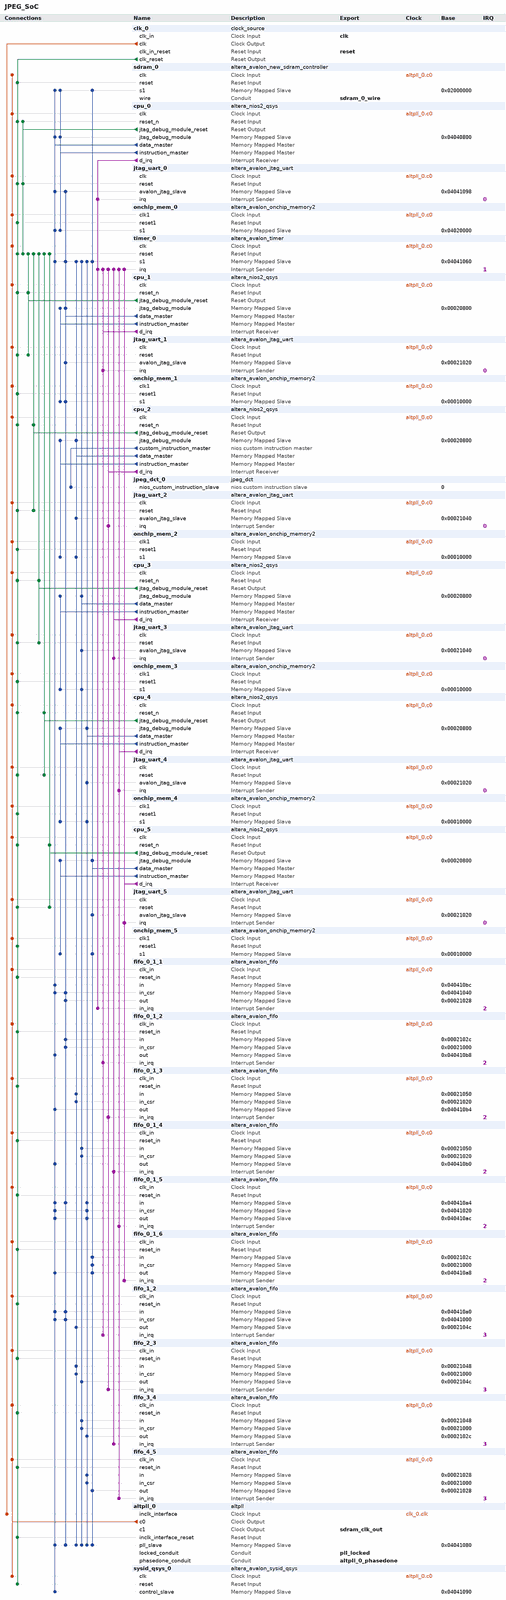
[diagram p0: system contents, whole]
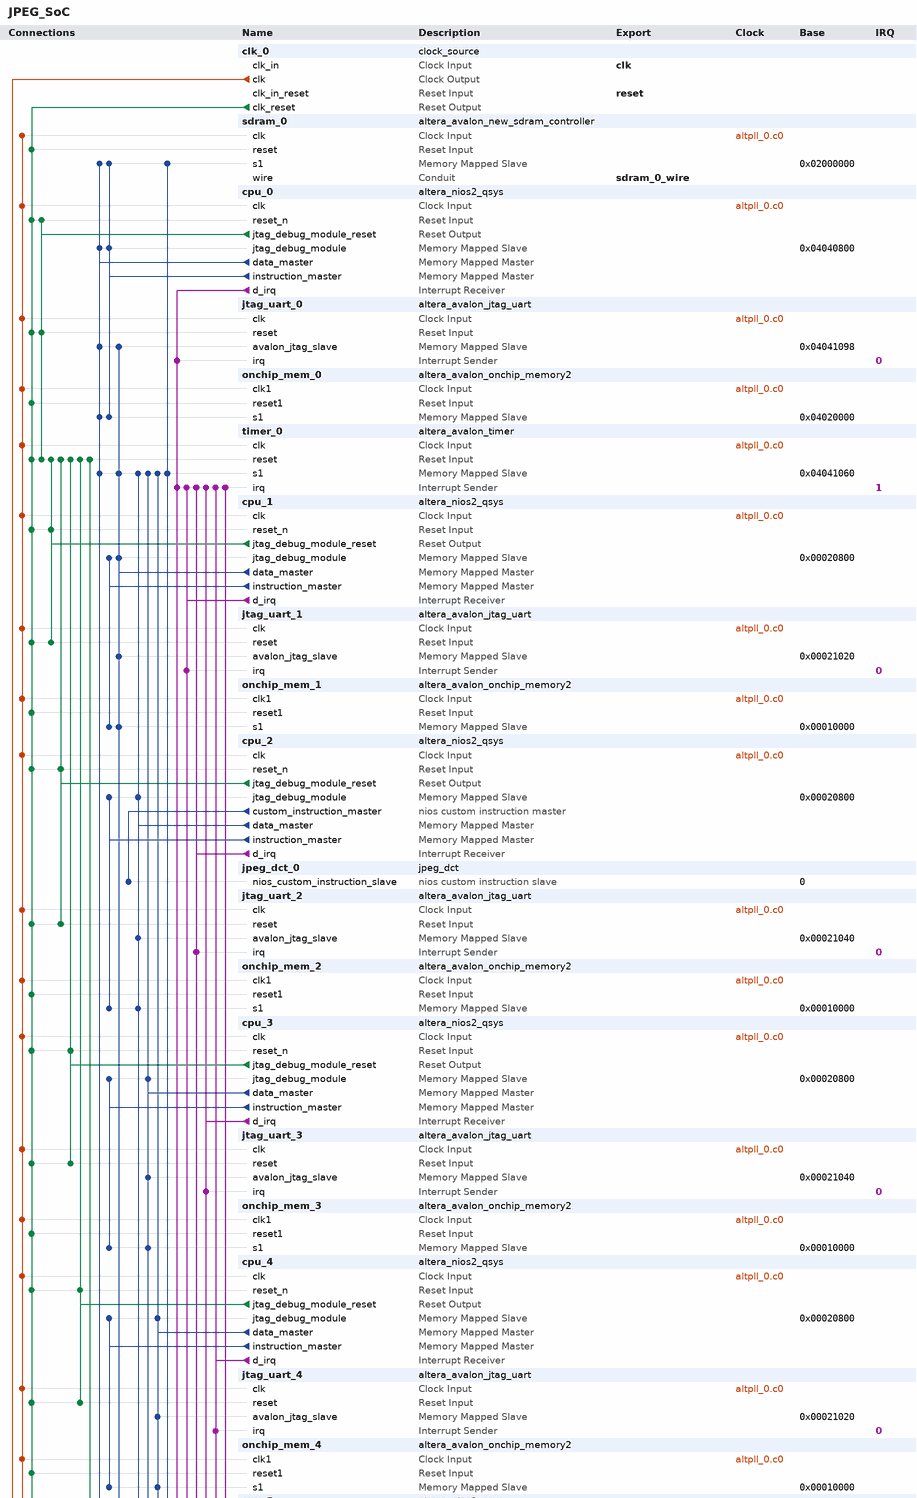
[diagram p1: system contents, upper part]
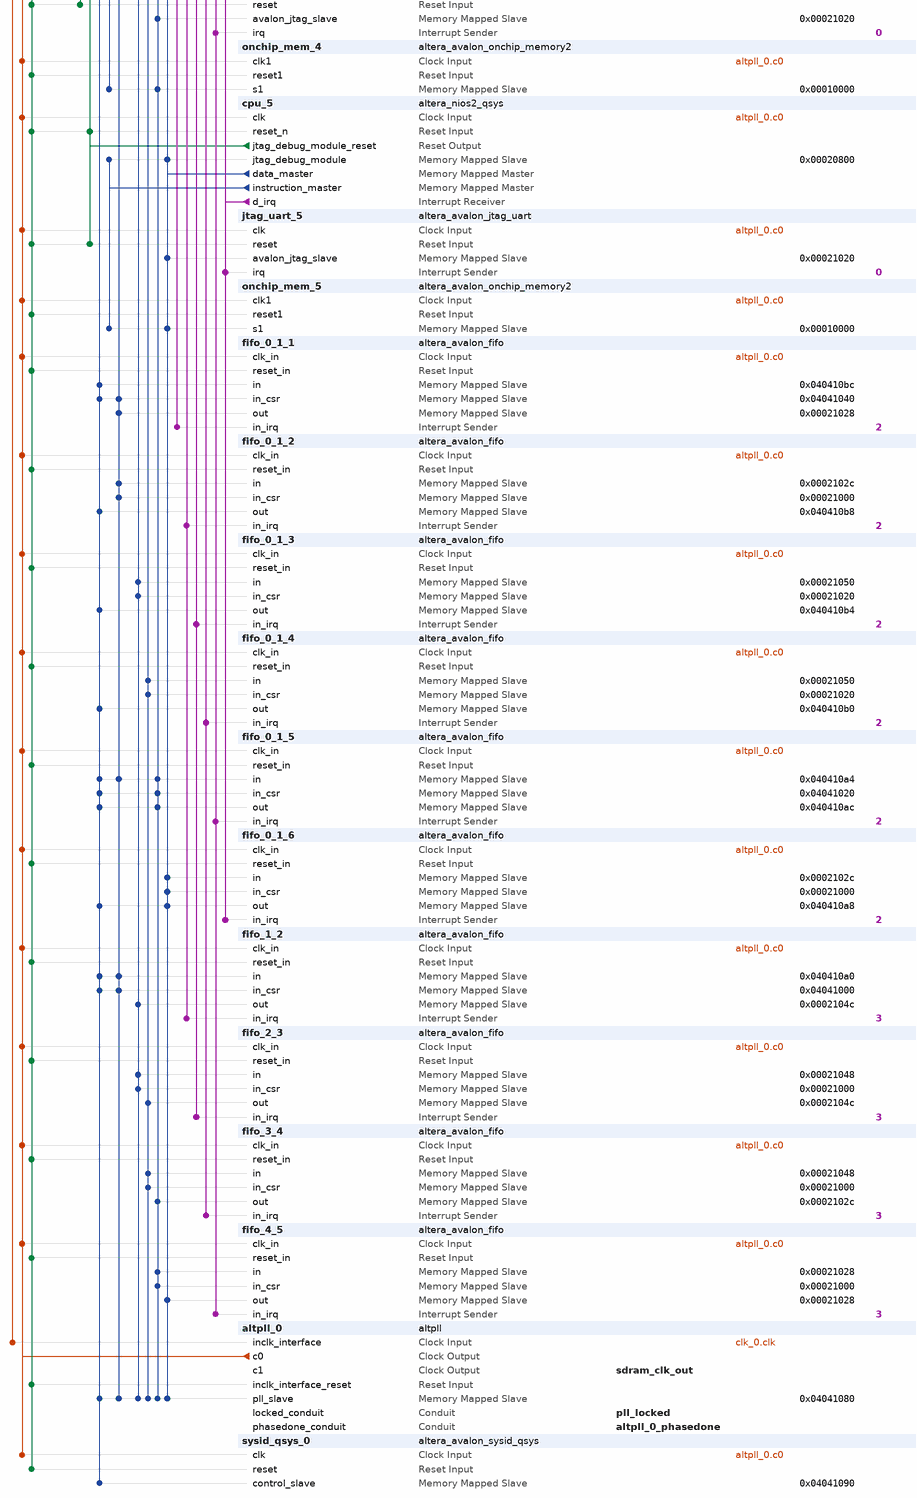
[diagram p2: system contents, lower part]
# Platform Designer (Qsys) system JPEG_SoC, Cyclone IV E EP4CE115F29C7
# Parameters at their usual value, and those the tool derives, are not listed.
package require -exact qsys 13.1
create_system JPEG_SoC
set_project_property DEVICE_FAMILY {Cyclone IV E}
set_project_property DEVICE EP4CE115F29C7

add_instance clk_0 clock_source 13.1
set_instance_parameter_value clk_0 clockFrequency 50000000

add_instance sdram_0 altera_avalon_new_sdram_controller 13.1
set_instance_parameter_value sdram_0 TAC 5.5
set_instance_parameter_value sdram_0 TRCD 20.0
set_instance_parameter_value sdram_0 TRP 20.0
set_instance_parameter_value sdram_0 casLatency 3
set_instance_parameter_value sdram_0 columnWidth 9
set_instance_parameter_value sdram_0 dataWidth 32
set_instance_parameter_value sdram_0 generateSimulationModel false
set_instance_parameter_value sdram_0 model custom
set_instance_parameter_value sdram_0 numberOfBanks 4
set_instance_parameter_value sdram_0 numberOfChipSelects 1
set_instance_parameter_value sdram_0 powerUpDelay 100.0
set_instance_parameter_value sdram_0 refreshPeriod 15.625
set_instance_parameter_value sdram_0 rowWidth 12

add_instance cpu_0 altera_nios2_qsys 13.1
set_instance_parameter_value cpu_0 resetSlave onchip_mem_0.s1
set_instance_parameter_value cpu_0 mmu_TLBMissExcSlave None
set_instance_parameter_value cpu_0 exceptionSlave onchip_mem_0.s1
set_instance_parameter_value cpu_0 breakSlave cpu_0.jtag_debug_module
set_instance_parameter_value cpu_0 muldiv_multiplierType DSPBlock
set_instance_parameter_value cpu_0 impl Tiny
set_instance_parameter_value cpu_0 icache_size 4096

add_instance jtag_uart_0 altera_avalon_jtag_uart 13.1
set_instance_parameter_value jtag_uart_0 simInteractiveOptions NO_INTERACTIVE_WINDOWS

add_instance onchip_mem_0 altera_avalon_onchip_memory2 13.1
set_instance_parameter_value onchip_mem_0 dataWidth 32
set_instance_parameter_value onchip_mem_0 dualPort false
set_instance_parameter_value onchip_mem_0 initMemContent true
set_instance_parameter_value onchip_mem_0 initializationFileName onchip_mem.hex
set_instance_parameter_value onchip_mem_0 memorySize 131072

add_instance timer_0 altera_avalon_timer 13.1
set_instance_parameter_value timer_0 period 1
set_instance_parameter_value timer_0 periodUnits MSEC

add_instance cpu_1 altera_nios2_qsys 13.1
set_instance_parameter_value cpu_1 cpuID 1
set_instance_parameter_value cpu_1 resetSlave onchip_mem_1.s1
set_instance_parameter_value cpu_1 mmu_TLBMissExcSlave None
set_instance_parameter_value cpu_1 exceptionSlave onchip_mem_1.s1
set_instance_parameter_value cpu_1 breakSlave cpu_1.jtag_debug_module
set_instance_parameter_value cpu_1 muldiv_multiplierType DSPBlock
set_instance_parameter_value cpu_1 impl Tiny
set_instance_parameter_value cpu_1 icache_size 4096

add_instance jtag_uart_1 altera_avalon_jtag_uart 13.1
set_instance_parameter_value jtag_uart_1 simInteractiveOptions NO_INTERACTIVE_WINDOWS

add_instance onchip_mem_1 altera_avalon_onchip_memory2 13.1
set_instance_parameter_value onchip_mem_1 dataWidth 32
set_instance_parameter_value onchip_mem_1 dualPort false
set_instance_parameter_value onchip_mem_1 initMemContent true
set_instance_parameter_value onchip_mem_1 initializationFileName onchip_mem.hex
set_instance_parameter_value onchip_mem_1 memorySize 49152

add_instance cpu_2 altera_nios2_qsys 13.1
set_instance_parameter_value cpu_2 cpuID 2
set_instance_parameter_value cpu_2 resetSlave onchip_mem_2.s1
set_instance_parameter_value cpu_2 mmu_TLBMissExcSlave None
set_instance_parameter_value cpu_2 exceptionSlave onchip_mem_2.s1
set_instance_parameter_value cpu_2 breakSlave cpu_2.jtag_debug_module
set_instance_parameter_value cpu_2 muldiv_multiplierType DSPBlock
set_instance_parameter_value cpu_2 impl Tiny
set_instance_parameter_value cpu_2 icache_size 4096

add_instance jpeg_dct_0 jpeg_dct 2.0

add_instance jtag_uart_2 altera_avalon_jtag_uart 13.1
set_instance_parameter_value jtag_uart_2 simInteractiveOptions NO_INTERACTIVE_WINDOWS

add_instance onchip_mem_2 altera_avalon_onchip_memory2 13.1
set_instance_parameter_value onchip_mem_2 dataWidth 32
set_instance_parameter_value onchip_mem_2 dualPort false
set_instance_parameter_value onchip_mem_2 initMemContent true
set_instance_parameter_value onchip_mem_2 initializationFileName onchip_mem.hex
set_instance_parameter_value onchip_mem_2 memorySize 49152

add_instance cpu_3 altera_nios2_qsys 13.1
set_instance_parameter_value cpu_3 cpuID 3
set_instance_parameter_value cpu_3 resetSlave onchip_mem_3.s1
set_instance_parameter_value cpu_3 mmu_TLBMissExcSlave None
set_instance_parameter_value cpu_3 exceptionSlave onchip_mem_3.s1
set_instance_parameter_value cpu_3 breakSlave cpu_3.jtag_debug_module
set_instance_parameter_value cpu_3 muldiv_multiplierType DSPBlock
set_instance_parameter_value cpu_3 impl Tiny
set_instance_parameter_value cpu_3 icache_size 4096

add_instance jtag_uart_3 altera_avalon_jtag_uart 13.1
set_instance_parameter_value jtag_uart_3 simInteractiveOptions NO_INTERACTIVE_WINDOWS

add_instance onchip_mem_3 altera_avalon_onchip_memory2 13.1
set_instance_parameter_value onchip_mem_3 dataWidth 32
set_instance_parameter_value onchip_mem_3 dualPort false
set_instance_parameter_value onchip_mem_3 initMemContent true
set_instance_parameter_value onchip_mem_3 initializationFileName onchip_mem.hex
set_instance_parameter_value onchip_mem_3 memorySize 49152

add_instance cpu_4 altera_nios2_qsys 13.1
set_instance_parameter_value cpu_4 cpuID 4
set_instance_parameter_value cpu_4 resetSlave onchip_mem_4.s1
set_instance_parameter_value cpu_4 mmu_TLBMissExcSlave None
set_instance_parameter_value cpu_4 exceptionSlave onchip_mem_4.s1
set_instance_parameter_value cpu_4 breakSlave cpu_4.jtag_debug_module
set_instance_parameter_value cpu_4 muldiv_multiplierType DSPBlock
set_instance_parameter_value cpu_4 impl Tiny
set_instance_parameter_value cpu_4 icache_size 4096

add_instance jtag_uart_4 altera_avalon_jtag_uart 13.1
set_instance_parameter_value jtag_uart_4 simInteractiveOptions NO_INTERACTIVE_WINDOWS

add_instance onchip_mem_4 altera_avalon_onchip_memory2 13.1
set_instance_parameter_value onchip_mem_4 dataWidth 32
set_instance_parameter_value onchip_mem_4 dualPort false
set_instance_parameter_value onchip_mem_4 initMemContent true
set_instance_parameter_value onchip_mem_4 initializationFileName onchip_mem.hex
set_instance_parameter_value onchip_mem_4 memorySize 65536

add_instance cpu_5 altera_nios2_qsys 13.1
set_instance_parameter_value cpu_5 cpuID 5
set_instance_parameter_value cpu_5 resetSlave onchip_mem_5.s1
set_instance_parameter_value cpu_5 mmu_TLBMissExcSlave None
set_instance_parameter_value cpu_5 exceptionSlave onchip_mem_5.s1
set_instance_parameter_value cpu_5 breakSlave cpu_5.jtag_debug_module
set_instance_parameter_value cpu_5 muldiv_multiplierType DSPBlock
set_instance_parameter_value cpu_5 impl Tiny
set_instance_parameter_value cpu_5 icache_size 4096

add_instance jtag_uart_5 altera_avalon_jtag_uart 13.1
set_instance_parameter_value jtag_uart_5 simInteractiveOptions NO_INTERACTIVE_WINDOWS

add_instance onchip_mem_5 altera_avalon_onchip_memory2 13.1
set_instance_parameter_value onchip_mem_5 dataWidth 32
set_instance_parameter_value onchip_mem_5 dualPort false
set_instance_parameter_value onchip_mem_5 initMemContent true
set_instance_parameter_value onchip_mem_5 initializationFileName onchip_mem.hex
set_instance_parameter_value onchip_mem_5 memorySize 49152

add_instance fifo_0_1_1 altera_avalon_fifo 13.1
set_instance_parameter_value fifo_0_1_1 bitsPerSymbol 16
set_instance_parameter_value fifo_0_1_1 channelWidth 8
set_instance_parameter_value fifo_0_1_1 errorWidth 8
set_instance_parameter_value fifo_0_1_1 fifoDepth 64
set_instance_parameter_value fifo_0_1_1 fifoInputInterfaceOptions AVALONMM_WRITE
set_instance_parameter_value fifo_0_1_1 fifoOutputInterfaceOptions AVALONMM_READ
set_instance_parameter_value fifo_0_1_1 singleClockMode true
set_instance_parameter_value fifo_0_1_1 symbolsPerBeat 2
set_instance_parameter_value fifo_0_1_1 useIRQ true
set_instance_parameter_value fifo_0_1_1 usePacket true
set_instance_parameter_value fifo_0_1_1 useReadControl false

add_instance fifo_0_1_2 altera_avalon_fifo 13.1
set_instance_parameter_value fifo_0_1_2 bitsPerSymbol 16
set_instance_parameter_value fifo_0_1_2 channelWidth 8
set_instance_parameter_value fifo_0_1_2 errorWidth 8
set_instance_parameter_value fifo_0_1_2 fifoDepth 64
set_instance_parameter_value fifo_0_1_2 fifoInputInterfaceOptions AVALONMM_WRITE
set_instance_parameter_value fifo_0_1_2 fifoOutputInterfaceOptions AVALONMM_READ
set_instance_parameter_value fifo_0_1_2 singleClockMode true
set_instance_parameter_value fifo_0_1_2 symbolsPerBeat 2
set_instance_parameter_value fifo_0_1_2 useIRQ true
set_instance_parameter_value fifo_0_1_2 usePacket true
set_instance_parameter_value fifo_0_1_2 useReadControl false

add_instance fifo_0_1_3 altera_avalon_fifo 13.1
set_instance_parameter_value fifo_0_1_3 bitsPerSymbol 16
set_instance_parameter_value fifo_0_1_3 channelWidth 8
set_instance_parameter_value fifo_0_1_3 errorWidth 8
set_instance_parameter_value fifo_0_1_3 fifoDepth 64
set_instance_parameter_value fifo_0_1_3 fifoInputInterfaceOptions AVALONMM_WRITE
set_instance_parameter_value fifo_0_1_3 fifoOutputInterfaceOptions AVALONMM_READ
set_instance_parameter_value fifo_0_1_3 singleClockMode true
set_instance_parameter_value fifo_0_1_3 symbolsPerBeat 2
set_instance_parameter_value fifo_0_1_3 useIRQ true
set_instance_parameter_value fifo_0_1_3 usePacket true
set_instance_parameter_value fifo_0_1_3 useReadControl false

add_instance fifo_0_1_4 altera_avalon_fifo 13.1
set_instance_parameter_value fifo_0_1_4 bitsPerSymbol 16
set_instance_parameter_value fifo_0_1_4 channelWidth 8
set_instance_parameter_value fifo_0_1_4 errorWidth 8
set_instance_parameter_value fifo_0_1_4 fifoDepth 64
set_instance_parameter_value fifo_0_1_4 fifoInputInterfaceOptions AVALONMM_WRITE
set_instance_parameter_value fifo_0_1_4 fifoOutputInterfaceOptions AVALONMM_READ
set_instance_parameter_value fifo_0_1_4 singleClockMode true
set_instance_parameter_value fifo_0_1_4 symbolsPerBeat 2
set_instance_parameter_value fifo_0_1_4 useIRQ true
set_instance_parameter_value fifo_0_1_4 usePacket true
set_instance_parameter_value fifo_0_1_4 useReadControl false

add_instance fifo_0_1_5 altera_avalon_fifo 13.1
set_instance_parameter_value fifo_0_1_5 bitsPerSymbol 16
set_instance_parameter_value fifo_0_1_5 channelWidth 8
set_instance_parameter_value fifo_0_1_5 errorWidth 8
set_instance_parameter_value fifo_0_1_5 fifoDepth 64
set_instance_parameter_value fifo_0_1_5 fifoInputInterfaceOptions AVALONMM_WRITE
set_instance_parameter_value fifo_0_1_5 fifoOutputInterfaceOptions AVALONMM_READ
set_instance_parameter_value fifo_0_1_5 singleClockMode true
set_instance_parameter_value fifo_0_1_5 symbolsPerBeat 2
set_instance_parameter_value fifo_0_1_5 useIRQ true
set_instance_parameter_value fifo_0_1_5 usePacket true
set_instance_parameter_value fifo_0_1_5 useReadControl false

add_instance fifo_0_1_6 altera_avalon_fifo 13.1
set_instance_parameter_value fifo_0_1_6 bitsPerSymbol 16
set_instance_parameter_value fifo_0_1_6 channelWidth 8
set_instance_parameter_value fifo_0_1_6 errorWidth 8
set_instance_parameter_value fifo_0_1_6 fifoDepth 64
set_instance_parameter_value fifo_0_1_6 fifoInputInterfaceOptions AVALONMM_WRITE
set_instance_parameter_value fifo_0_1_6 fifoOutputInterfaceOptions AVALONMM_READ
set_instance_parameter_value fifo_0_1_6 singleClockMode true
set_instance_parameter_value fifo_0_1_6 symbolsPerBeat 2
set_instance_parameter_value fifo_0_1_6 useIRQ true
set_instance_parameter_value fifo_0_1_6 usePacket true
set_instance_parameter_value fifo_0_1_6 useReadControl false

add_instance fifo_1_2 altera_avalon_fifo 13.1
set_instance_parameter_value fifo_1_2 bitsPerSymbol 16
set_instance_parameter_value fifo_1_2 channelWidth 8
set_instance_parameter_value fifo_1_2 errorWidth 8
set_instance_parameter_value fifo_1_2 fifoDepth 64
set_instance_parameter_value fifo_1_2 fifoInputInterfaceOptions AVALONMM_WRITE
set_instance_parameter_value fifo_1_2 fifoOutputInterfaceOptions AVALONMM_READ
set_instance_parameter_value fifo_1_2 singleClockMode true
set_instance_parameter_value fifo_1_2 symbolsPerBeat 2
set_instance_parameter_value fifo_1_2 useIRQ true
set_instance_parameter_value fifo_1_2 usePacket true
set_instance_parameter_value fifo_1_2 useReadControl false

add_instance fifo_2_3 altera_avalon_fifo 13.1
set_instance_parameter_value fifo_2_3 bitsPerSymbol 16
set_instance_parameter_value fifo_2_3 channelWidth 8
set_instance_parameter_value fifo_2_3 errorWidth 8
set_instance_parameter_value fifo_2_3 fifoDepth 64
set_instance_parameter_value fifo_2_3 fifoInputInterfaceOptions AVALONMM_WRITE
set_instance_parameter_value fifo_2_3 fifoOutputInterfaceOptions AVALONMM_READ
set_instance_parameter_value fifo_2_3 singleClockMode true
set_instance_parameter_value fifo_2_3 symbolsPerBeat 2
set_instance_parameter_value fifo_2_3 useIRQ true
set_instance_parameter_value fifo_2_3 usePacket true
set_instance_parameter_value fifo_2_3 useReadControl false

add_instance fifo_3_4 altera_avalon_fifo 13.1
set_instance_parameter_value fifo_3_4 bitsPerSymbol 16
set_instance_parameter_value fifo_3_4 channelWidth 8
set_instance_parameter_value fifo_3_4 errorWidth 8
set_instance_parameter_value fifo_3_4 fifoDepth 64
set_instance_parameter_value fifo_3_4 fifoInputInterfaceOptions AVALONMM_WRITE
set_instance_parameter_value fifo_3_4 fifoOutputInterfaceOptions AVALONMM_READ
set_instance_parameter_value fifo_3_4 singleClockMode true
set_instance_parameter_value fifo_3_4 symbolsPerBeat 2
set_instance_parameter_value fifo_3_4 useIRQ true
set_instance_parameter_value fifo_3_4 usePacket true
set_instance_parameter_value fifo_3_4 useReadControl false

add_instance fifo_4_5 altera_avalon_fifo 13.1
set_instance_parameter_value fifo_4_5 bitsPerSymbol 16
set_instance_parameter_value fifo_4_5 channelWidth 8
set_instance_parameter_value fifo_4_5 errorWidth 8
set_instance_parameter_value fifo_4_5 fifoDepth 64
set_instance_parameter_value fifo_4_5 fifoInputInterfaceOptions AVALONMM_WRITE
set_instance_parameter_value fifo_4_5 fifoOutputInterfaceOptions AVALONMM_READ
set_instance_parameter_value fifo_4_5 singleClockMode true
set_instance_parameter_value fifo_4_5 symbolsPerBeat 2
set_instance_parameter_value fifo_4_5 useIRQ true
set_instance_parameter_value fifo_4_5 usePacket true
set_instance_parameter_value fifo_4_5 useReadControl false

add_instance altpll_0 altpll 13.1
set_instance_parameter_value altpll_0 INCLK0_INPUT_FREQUENCY 20000
set_instance_parameter_value altpll_0 CLK0_MULTIPLY_BY 1
set_instance_parameter_value altpll_0 CLK1_MULTIPLY_BY 1
set_instance_parameter_value altpll_0 CLK0_DIVIDE_BY 1
set_instance_parameter_value altpll_0 CLK1_DIVIDE_BY 1
set_instance_parameter_value altpll_0 CLK1_PHASE_SHIFT -3000
set_instance_parameter_value altpll_0 CLK1_DUTY_CYCLE 50
set_instance_parameter_value altpll_0 PORT_clk1 PORT_USED
set_instance_parameter_value altpll_0 PORT_clk2 PORT_UNUSED
set_instance_parameter_value altpll_0 PORT_clk3 PORT_UNUSED
set_instance_parameter_value altpll_0 PORT_ARESET PORT_UNUSED
set_instance_parameter_value altpll_0 PORT_LOCKED PORT_USED

add_instance sysid_qsys_0 altera_avalon_sysid_qsys 13.1
set_instance_parameter_value sysid_qsys_0 id 0

# connections
add_connection altpll_0.c0 cpu_0.clk clock
add_connection altpll_0.c0 cpu_1.clk clock
add_connection altpll_0.c0 cpu_2.clk clock
add_connection altpll_0.c0 cpu_3.clk clock
add_connection altpll_0.c0 cpu_4.clk clock
add_connection altpll_0.c0 cpu_5.clk clock
add_connection altpll_0.c0 fifo_0_1_1.clk_in clock
add_connection altpll_0.c0 fifo_0_1_2.clk_in clock
add_connection altpll_0.c0 fifo_0_1_3.clk_in clock
add_connection altpll_0.c0 fifo_0_1_4.clk_in clock
add_connection altpll_0.c0 fifo_0_1_5.clk_in clock
add_connection altpll_0.c0 fifo_0_1_6.clk_in clock
add_connection altpll_0.c0 fifo_1_2.clk_in clock
add_connection altpll_0.c0 fifo_2_3.clk_in clock
add_connection altpll_0.c0 fifo_3_4.clk_in clock
add_connection altpll_0.c0 fifo_4_5.clk_in clock
add_connection altpll_0.c0 jtag_uart_0.clk clock
add_connection altpll_0.c0 jtag_uart_1.clk clock
add_connection altpll_0.c0 jtag_uart_2.clk clock
add_connection altpll_0.c0 jtag_uart_3.clk clock
add_connection altpll_0.c0 jtag_uart_4.clk clock
add_connection altpll_0.c0 jtag_uart_5.clk clock
add_connection altpll_0.c0 onchip_mem_0.clk1 clock
add_connection altpll_0.c0 onchip_mem_1.clk1 clock
add_connection altpll_0.c0 onchip_mem_2.clk1 clock
add_connection altpll_0.c0 onchip_mem_3.clk1 clock
add_connection altpll_0.c0 onchip_mem_4.clk1 clock
add_connection altpll_0.c0 onchip_mem_5.clk1 clock
add_connection altpll_0.c0 sdram_0.clk clock
add_connection altpll_0.c0 sysid_qsys_0.clk clock
add_connection altpll_0.c0 timer_0.clk clock
add_connection clk_0.clk altpll_0.inclk_interface clock
add_connection clk_0.clk_reset altpll_0.inclk_interface_reset reset
add_connection clk_0.clk_reset cpu_0.reset_n reset
add_connection clk_0.clk_reset cpu_1.reset_n reset
add_connection clk_0.clk_reset cpu_2.reset_n reset
add_connection clk_0.clk_reset cpu_3.reset_n reset
add_connection clk_0.clk_reset cpu_4.reset_n reset
add_connection clk_0.clk_reset cpu_5.reset_n reset
add_connection clk_0.clk_reset fifo_0_1_1.reset_in reset
add_connection clk_0.clk_reset fifo_0_1_2.reset_in reset
add_connection clk_0.clk_reset fifo_0_1_3.reset_in reset
add_connection clk_0.clk_reset fifo_0_1_4.reset_in reset
add_connection clk_0.clk_reset fifo_0_1_5.reset_in reset
add_connection clk_0.clk_reset fifo_0_1_6.reset_in reset
add_connection clk_0.clk_reset fifo_1_2.reset_in reset
add_connection clk_0.clk_reset fifo_2_3.reset_in reset
add_connection clk_0.clk_reset fifo_3_4.reset_in reset
add_connection clk_0.clk_reset fifo_4_5.reset_in reset
add_connection clk_0.clk_reset jtag_uart_0.reset reset
add_connection clk_0.clk_reset jtag_uart_1.reset reset
add_connection clk_0.clk_reset jtag_uart_2.reset reset
add_connection clk_0.clk_reset jtag_uart_3.reset reset
add_connection clk_0.clk_reset jtag_uart_4.reset reset
add_connection clk_0.clk_reset jtag_uart_5.reset reset
add_connection clk_0.clk_reset onchip_mem_0.reset1 reset
add_connection clk_0.clk_reset onchip_mem_1.reset1 reset
add_connection clk_0.clk_reset onchip_mem_2.reset1 reset
add_connection clk_0.clk_reset onchip_mem_3.reset1 reset
add_connection clk_0.clk_reset onchip_mem_4.reset1 reset
add_connection clk_0.clk_reset onchip_mem_5.reset1 reset
add_connection clk_0.clk_reset sdram_0.reset reset
add_connection clk_0.clk_reset sysid_qsys_0.reset reset
add_connection clk_0.clk_reset timer_0.reset reset
add_connection cpu_0.jtag_debug_module_reset cpu_0.reset_n reset
add_connection cpu_0.jtag_debug_module_reset jtag_uart_0.reset reset
add_connection cpu_0.jtag_debug_module_reset timer_0.reset reset
add_connection cpu_1.jtag_debug_module_reset cpu_1.reset_n reset
add_connection cpu_1.jtag_debug_module_reset jtag_uart_1.reset reset
add_connection cpu_1.jtag_debug_module_reset timer_0.reset reset
add_connection cpu_2.jtag_debug_module_reset cpu_2.reset_n reset
add_connection cpu_2.jtag_debug_module_reset jtag_uart_2.reset reset
add_connection cpu_2.jtag_debug_module_reset timer_0.reset reset
add_connection cpu_3.jtag_debug_module_reset cpu_3.reset_n reset
add_connection cpu_3.jtag_debug_module_reset jtag_uart_3.reset reset
add_connection cpu_3.jtag_debug_module_reset timer_0.reset reset
add_connection cpu_4.jtag_debug_module_reset cpu_4.reset_n reset
add_connection cpu_4.jtag_debug_module_reset jtag_uart_4.reset reset
add_connection cpu_4.jtag_debug_module_reset timer_0.reset reset
add_connection cpu_5.jtag_debug_module_reset cpu_5.reset_n reset
add_connection cpu_5.jtag_debug_module_reset jtag_uart_5.reset reset
add_connection cpu_5.jtag_debug_module_reset timer_0.reset reset
add_connection cpu_0.data_master altpll_0.pll_slave avalon
set_connection_parameter_value cpu_0.data_master/altpll_0.pll_slave baseAddress 0x04041080
add_connection cpu_0.data_master cpu_0.jtag_debug_module avalon
set_connection_parameter_value cpu_0.data_master/cpu_0.jtag_debug_module baseAddress 0x04040800
add_connection cpu_0.data_master fifo_0_1_1.in avalon
set_connection_parameter_value cpu_0.data_master/fifo_0_1_1.in baseAddress 0x040410bc
add_connection cpu_0.data_master fifo_0_1_1.in_csr avalon
set_connection_parameter_value cpu_0.data_master/fifo_0_1_1.in_csr baseAddress 0x04041040
add_connection cpu_0.data_master fifo_0_1_2.out avalon
set_connection_parameter_value cpu_0.data_master/fifo_0_1_2.out baseAddress 0x040410b8
add_connection cpu_0.data_master fifo_0_1_3.out avalon
set_connection_parameter_value cpu_0.data_master/fifo_0_1_3.out baseAddress 0x040410b4
add_connection cpu_0.data_master fifo_0_1_4.out avalon
set_connection_parameter_value cpu_0.data_master/fifo_0_1_4.out baseAddress 0x040410b0
add_connection cpu_0.data_master fifo_0_1_5.in avalon
set_connection_parameter_value cpu_0.data_master/fifo_0_1_5.in baseAddress 0x040410a4
add_connection cpu_0.data_master fifo_0_1_5.in_csr avalon
set_connection_parameter_value cpu_0.data_master/fifo_0_1_5.in_csr baseAddress 0x04041020
add_connection cpu_0.data_master fifo_0_1_5.out avalon
set_connection_parameter_value cpu_0.data_master/fifo_0_1_5.out baseAddress 0x040410ac
add_connection cpu_0.data_master fifo_0_1_6.out avalon
set_connection_parameter_value cpu_0.data_master/fifo_0_1_6.out baseAddress 0x040410a8
add_connection cpu_0.data_master fifo_1_2.in avalon
set_connection_parameter_value cpu_0.data_master/fifo_1_2.in baseAddress 0x040410a0
add_connection cpu_0.data_master fifo_1_2.in_csr avalon
set_connection_parameter_value cpu_0.data_master/fifo_1_2.in_csr baseAddress 0x04041000
add_connection cpu_0.data_master jtag_uart_0.avalon_jtag_slave avalon
set_connection_parameter_value cpu_0.data_master/jtag_uart_0.avalon_jtag_slave baseAddress 0x04041098
add_connection cpu_0.data_master onchip_mem_0.s1 avalon
set_connection_parameter_value cpu_0.data_master/onchip_mem_0.s1 baseAddress 0x04020000
add_connection cpu_0.data_master sdram_0.s1 avalon
set_connection_parameter_value cpu_0.data_master/sdram_0.s1 baseAddress 0x02000000
add_connection cpu_0.data_master sysid_qsys_0.control_slave avalon
set_connection_parameter_value cpu_0.data_master/sysid_qsys_0.control_slave baseAddress 0x04041090
add_connection cpu_0.data_master timer_0.s1 avalon
set_connection_parameter_value cpu_0.data_master/timer_0.s1 baseAddress 0x04041060
add_connection cpu_0.instruction_master cpu_0.jtag_debug_module avalon
set_connection_parameter_value cpu_0.instruction_master/cpu_0.jtag_debug_module baseAddress 0x04040800
add_connection cpu_0.instruction_master onchip_mem_0.s1 avalon
set_connection_parameter_value cpu_0.instruction_master/onchip_mem_0.s1 baseAddress 0x04020000
add_connection cpu_0.instruction_master sdram_0.s1 avalon
set_connection_parameter_value cpu_0.instruction_master/sdram_0.s1 baseAddress 0x02000000
add_connection cpu_1.data_master altpll_0.pll_slave avalon
set_connection_parameter_value cpu_1.data_master/altpll_0.pll_slave baseAddress 0x04041080
add_connection cpu_1.data_master cpu_1.jtag_debug_module avalon
set_connection_parameter_value cpu_1.data_master/cpu_1.jtag_debug_module baseAddress 0x00020800
add_connection cpu_1.data_master fifo_0_1_1.in_csr avalon
set_connection_parameter_value cpu_1.data_master/fifo_0_1_1.in_csr baseAddress 0x04041040
add_connection cpu_1.data_master fifo_0_1_1.out avalon
set_connection_parameter_value cpu_1.data_master/fifo_0_1_1.out baseAddress 0x00021028
add_connection cpu_1.data_master fifo_0_1_2.in avalon
set_connection_parameter_value cpu_1.data_master/fifo_0_1_2.in baseAddress 0x0002102c
add_connection cpu_1.data_master fifo_0_1_2.in_csr avalon
set_connection_parameter_value cpu_1.data_master/fifo_0_1_2.in_csr baseAddress 0x00021000
add_connection cpu_1.data_master fifo_0_1_5.in avalon
set_connection_parameter_value cpu_1.data_master/fifo_0_1_5.in baseAddress 0x040410a4
add_connection cpu_1.data_master fifo_1_2.in avalon
set_connection_parameter_value cpu_1.data_master/fifo_1_2.in baseAddress 0x040410a0
add_connection cpu_1.data_master fifo_1_2.in_csr avalon
set_connection_parameter_value cpu_1.data_master/fifo_1_2.in_csr baseAddress 0x04041000
add_connection cpu_1.data_master jtag_uart_0.avalon_jtag_slave avalon
set_connection_parameter_value cpu_1.data_master/jtag_uart_0.avalon_jtag_slave baseAddress 0x04041098
add_connection cpu_1.data_master jtag_uart_1.avalon_jtag_slave avalon
set_connection_parameter_value cpu_1.data_master/jtag_uart_1.avalon_jtag_slave baseAddress 0x00021020
add_connection cpu_1.data_master onchip_mem_1.s1 avalon
set_connection_parameter_value cpu_1.data_master/onchip_mem_1.s1 baseAddress 0x00010000
add_connection cpu_1.data_master timer_0.s1 avalon
set_connection_parameter_value cpu_1.data_master/timer_0.s1 baseAddress 0x04041060
add_connection cpu_1.instruction_master cpu_1.jtag_debug_module avalon
set_connection_parameter_value cpu_1.instruction_master/cpu_1.jtag_debug_module baseAddress 0x00020800
add_connection cpu_1.instruction_master onchip_mem_1.s1 avalon
set_connection_parameter_value cpu_1.instruction_master/onchip_mem_1.s1 baseAddress 0x00010000
add_connection cpu_2.data_master altpll_0.pll_slave avalon
set_connection_parameter_value cpu_2.data_master/altpll_0.pll_slave baseAddress 0x04041080
add_connection cpu_2.data_master cpu_2.jtag_debug_module avalon
set_connection_parameter_value cpu_2.data_master/cpu_2.jtag_debug_module baseAddress 0x00020800
add_connection cpu_2.data_master fifo_0_1_3.in avalon
set_connection_parameter_value cpu_2.data_master/fifo_0_1_3.in baseAddress 0x00021050
add_connection cpu_2.data_master fifo_0_1_3.in_csr avalon
set_connection_parameter_value cpu_2.data_master/fifo_0_1_3.in_csr baseAddress 0x00021020
add_connection cpu_2.data_master fifo_1_2.out avalon
set_connection_parameter_value cpu_2.data_master/fifo_1_2.out baseAddress 0x0002104c
add_connection cpu_2.data_master fifo_2_3.in avalon
set_connection_parameter_value cpu_2.data_master/fifo_2_3.in baseAddress 0x00021048
add_connection cpu_2.data_master fifo_2_3.in_csr avalon
set_connection_parameter_value cpu_2.data_master/fifo_2_3.in_csr baseAddress 0x00021000
add_connection cpu_2.data_master jtag_uart_2.avalon_jtag_slave avalon
set_connection_parameter_value cpu_2.data_master/jtag_uart_2.avalon_jtag_slave baseAddress 0x00021040
add_connection cpu_2.data_master onchip_mem_2.s1 avalon
set_connection_parameter_value cpu_2.data_master/onchip_mem_2.s1 baseAddress 0x00010000
add_connection cpu_2.data_master timer_0.s1 avalon
set_connection_parameter_value cpu_2.data_master/timer_0.s1 baseAddress 0x04041060
add_connection cpu_2.instruction_master cpu_2.jtag_debug_module avalon
set_connection_parameter_value cpu_2.instruction_master/cpu_2.jtag_debug_module baseAddress 0x00020800
add_connection cpu_2.instruction_master onchip_mem_2.s1 avalon
set_connection_parameter_value cpu_2.instruction_master/onchip_mem_2.s1 baseAddress 0x00010000
add_connection cpu_3.data_master altpll_0.pll_slave avalon
set_connection_parameter_value cpu_3.data_master/altpll_0.pll_slave baseAddress 0x04041080
add_connection cpu_3.data_master cpu_3.jtag_debug_module avalon
set_connection_parameter_value cpu_3.data_master/cpu_3.jtag_debug_module baseAddress 0x00020800
add_connection cpu_3.data_master fifo_0_1_4.in avalon
set_connection_parameter_value cpu_3.data_master/fifo_0_1_4.in baseAddress 0x00021050
add_connection cpu_3.data_master fifo_0_1_4.in_csr avalon
set_connection_parameter_value cpu_3.data_master/fifo_0_1_4.in_csr baseAddress 0x00021020
add_connection cpu_3.data_master fifo_2_3.out avalon
set_connection_parameter_value cpu_3.data_master/fifo_2_3.out baseAddress 0x0002104c
add_connection cpu_3.data_master fifo_3_4.in avalon
set_connection_parameter_value cpu_3.data_master/fifo_3_4.in baseAddress 0x00021048
add_connection cpu_3.data_master fifo_3_4.in_csr avalon
set_connection_parameter_value cpu_3.data_master/fifo_3_4.in_csr baseAddress 0x00021000
add_connection cpu_3.data_master jtag_uart_3.avalon_jtag_slave avalon
set_connection_parameter_value cpu_3.data_master/jtag_uart_3.avalon_jtag_slave baseAddress 0x00021040
add_connection cpu_3.data_master onchip_mem_3.s1 avalon
set_connection_parameter_value cpu_3.data_master/onchip_mem_3.s1 baseAddress 0x00010000
add_connection cpu_3.data_master timer_0.s1 avalon
set_connection_parameter_value cpu_3.data_master/timer_0.s1 baseAddress 0x04041060
add_connection cpu_3.instruction_master cpu_3.jtag_debug_module avalon
set_connection_parameter_value cpu_3.instruction_master/cpu_3.jtag_debug_module baseAddress 0x00020800
add_connection cpu_3.instruction_master onchip_mem_3.s1 avalon
set_connection_parameter_value cpu_3.instruction_master/onchip_mem_3.s1 baseAddress 0x00010000
add_connection cpu_4.data_master altpll_0.pll_slave avalon
set_connection_parameter_value cpu_4.data_master/altpll_0.pll_slave baseAddress 0x04041080
add_connection cpu_4.data_master cpu_4.jtag_debug_module avalon
set_connection_parameter_value cpu_4.data_master/cpu_4.jtag_debug_module baseAddress 0x00020800
add_connection cpu_4.data_master fifo_0_1_5.in avalon
set_connection_parameter_value cpu_4.data_master/fifo_0_1_5.in baseAddress 0x040410a4
add_connection cpu_4.data_master fifo_0_1_5.in_csr avalon
set_connection_parameter_value cpu_4.data_master/fifo_0_1_5.in_csr baseAddress 0x04041020
add_connection cpu_4.data_master fifo_0_1_5.out avalon
set_connection_parameter_value cpu_4.data_master/fifo_0_1_5.out baseAddress 0x040410ac
add_connection cpu_4.data_master fifo_3_4.out avalon
set_connection_parameter_value cpu_4.data_master/fifo_3_4.out baseAddress 0x0002102c
add_connection cpu_4.data_master fifo_4_5.in avalon
set_connection_parameter_value cpu_4.data_master/fifo_4_5.in baseAddress 0x00021028
add_connection cpu_4.data_master fifo_4_5.in_csr avalon
set_connection_parameter_value cpu_4.data_master/fifo_4_5.in_csr baseAddress 0x00021000
add_connection cpu_4.data_master jtag_uart_4.avalon_jtag_slave avalon
set_connection_parameter_value cpu_4.data_master/jtag_uart_4.avalon_jtag_slave baseAddress 0x00021020
add_connection cpu_4.data_master onchip_mem_4.s1 avalon
set_connection_parameter_value cpu_4.data_master/onchip_mem_4.s1 baseAddress 0x00010000
add_connection cpu_4.data_master timer_0.s1 avalon
set_connection_parameter_value cpu_4.data_master/timer_0.s1 baseAddress 0x04041060
add_connection cpu_4.instruction_master cpu_4.jtag_debug_module avalon
set_connection_parameter_value cpu_4.instruction_master/cpu_4.jtag_debug_module baseAddress 0x00020800
add_connection cpu_4.instruction_master onchip_mem_4.s1 avalon
set_connection_parameter_value cpu_4.instruction_master/onchip_mem_4.s1 baseAddress 0x00010000
add_connection cpu_5.data_master altpll_0.pll_slave avalon
set_connection_parameter_value cpu_5.data_master/altpll_0.pll_slave baseAddress 0x04041080
add_connection cpu_5.data_master cpu_5.jtag_debug_module avalon
set_connection_parameter_value cpu_5.data_master/cpu_5.jtag_debug_module baseAddress 0x00020800
add_connection cpu_5.data_master fifo_0_1_6.in avalon
set_connection_parameter_value cpu_5.data_master/fifo_0_1_6.in baseAddress 0x0002102c
add_connection cpu_5.data_master fifo_0_1_6.in_csr avalon
set_connection_parameter_value cpu_5.data_master/fifo_0_1_6.in_csr baseAddress 0x00021000
add_connection cpu_5.data_master fifo_0_1_6.out avalon
set_connection_parameter_value cpu_5.data_master/fifo_0_1_6.out baseAddress 0x040410a8
add_connection cpu_5.data_master fifo_4_5.out avalon
set_connection_parameter_value cpu_5.data_master/fifo_4_5.out baseAddress 0x00021028
add_connection cpu_5.data_master jtag_uart_5.avalon_jtag_slave avalon
set_connection_parameter_value cpu_5.data_master/jtag_uart_5.avalon_jtag_slave baseAddress 0x00021020
add_connection cpu_5.data_master onchip_mem_5.s1 avalon
set_connection_parameter_value cpu_5.data_master/onchip_mem_5.s1 baseAddress 0x00010000
add_connection cpu_5.data_master sdram_0.s1 avalon
set_connection_parameter_value cpu_5.data_master/sdram_0.s1 baseAddress 0x02000000
add_connection cpu_5.data_master timer_0.s1 avalon
set_connection_parameter_value cpu_5.data_master/timer_0.s1 baseAddress 0x04041060
add_connection cpu_5.instruction_master cpu_5.jtag_debug_module avalon
set_connection_parameter_value cpu_5.instruction_master/cpu_5.jtag_debug_module baseAddress 0x00020800
add_connection cpu_5.instruction_master onchip_mem_5.s1 avalon
set_connection_parameter_value cpu_5.instruction_master/onchip_mem_5.s1 baseAddress 0x00010000
add_connection cpu_0.d_irq fifo_0_1_1.in_irq interrupt
set_connection_parameter_value cpu_0.d_irq/fifo_0_1_1.in_irq irqNumber 2
add_connection cpu_0.d_irq jtag_uart_0.irq interrupt
set_connection_parameter_value cpu_0.d_irq/jtag_uart_0.irq irqNumber 0
add_connection cpu_0.d_irq timer_0.irq interrupt
set_connection_parameter_value cpu_0.d_irq/timer_0.irq irqNumber 1
add_connection cpu_1.d_irq fifo_0_1_2.in_irq interrupt
set_connection_parameter_value cpu_1.d_irq/fifo_0_1_2.in_irq irqNumber 2
add_connection cpu_1.d_irq fifo_1_2.in_irq interrupt
set_connection_parameter_value cpu_1.d_irq/fifo_1_2.in_irq irqNumber 3
add_connection cpu_1.d_irq jtag_uart_1.irq interrupt
set_connection_parameter_value cpu_1.d_irq/jtag_uart_1.irq irqNumber 0
add_connection cpu_1.d_irq timer_0.irq interrupt
set_connection_parameter_value cpu_1.d_irq/timer_0.irq irqNumber 1
add_connection cpu_2.d_irq fifo_0_1_3.in_irq interrupt
set_connection_parameter_value cpu_2.d_irq/fifo_0_1_3.in_irq irqNumber 2
add_connection cpu_2.d_irq fifo_2_3.in_irq interrupt
set_connection_parameter_value cpu_2.d_irq/fifo_2_3.in_irq irqNumber 3
add_connection cpu_2.d_irq jtag_uart_2.irq interrupt
set_connection_parameter_value cpu_2.d_irq/jtag_uart_2.irq irqNumber 0
add_connection cpu_2.d_irq timer_0.irq interrupt
set_connection_parameter_value cpu_2.d_irq/timer_0.irq irqNumber 1
add_connection cpu_3.d_irq fifo_0_1_4.in_irq interrupt
set_connection_parameter_value cpu_3.d_irq/fifo_0_1_4.in_irq irqNumber 2
add_connection cpu_3.d_irq fifo_3_4.in_irq interrupt
set_connection_parameter_value cpu_3.d_irq/fifo_3_4.in_irq irqNumber 3
add_connection cpu_3.d_irq jtag_uart_3.irq interrupt
set_connection_parameter_value cpu_3.d_irq/jtag_uart_3.irq irqNumber 0
add_connection cpu_3.d_irq timer_0.irq interrupt
set_connection_parameter_value cpu_3.d_irq/timer_0.irq irqNumber 1
add_connection cpu_4.d_irq fifo_0_1_5.in_irq interrupt
set_connection_parameter_value cpu_4.d_irq/fifo_0_1_5.in_irq irqNumber 2
add_connection cpu_4.d_irq fifo_4_5.in_irq interrupt
set_connection_parameter_value cpu_4.d_irq/fifo_4_5.in_irq irqNumber 3
add_connection cpu_4.d_irq jtag_uart_4.irq interrupt
set_connection_parameter_value cpu_4.d_irq/jtag_uart_4.irq irqNumber 0
add_connection cpu_4.d_irq timer_0.irq interrupt
set_connection_parameter_value cpu_4.d_irq/timer_0.irq irqNumber 1
add_connection cpu_5.d_irq fifo_0_1_6.in_irq interrupt
set_connection_parameter_value cpu_5.d_irq/fifo_0_1_6.in_irq irqNumber 2
add_connection cpu_5.d_irq jtag_uart_5.irq interrupt
set_connection_parameter_value cpu_5.d_irq/jtag_uart_5.irq irqNumber 0
add_connection cpu_5.d_irq timer_0.irq interrupt
set_connection_parameter_value cpu_5.d_irq/timer_0.irq irqNumber 1
add_connection cpu_2.custom_instruction_master jpeg_dct_0.nios_custom_instruction_slave nios_custom_instruction
set_connection_parameter_value cpu_2.custom_instruction_master/jpeg_dct_0.nios_custom_instruction_slave CIName jpeg_dct_0
set_connection_parameter_value cpu_2.custom_instruction_master/jpeg_dct_0.nios_custom_instruction_slave baseAddress 0

# exported interfaces
add_interface clk clock sink
set_interface_property clk EXPORT_OF clk_0.clk_in
add_interface reset reset sink
set_interface_property reset EXPORT_OF clk_0.clk_in_reset
add_interface altpll_0_phasedone conduit end
set_interface_property altpll_0_phasedone EXPORT_OF altpll_0.phasedone_conduit
add_interface pll_locked conduit end
set_interface_property pll_locked EXPORT_OF altpll_0.locked_conduit
add_interface sdram_clk_out clock source
set_interface_property sdram_clk_out EXPORT_OF altpll_0.c1
add_interface sdram_0_wire conduit end
set_interface_property sdram_0_wire EXPORT_OF sdram_0.wire

set_interconnect_requirement {$system} qsys_mm.clockCrossingAdapter HANDSHAKE
set_interconnect_requirement {$system} qsys_mm.maxAdditionalLatency 1
set_interconnect_requirement {$system} qsys_mm.insertDefaultSlave false

save_system JPEG_SoC.qsys
